# EAGLE design Program Counter (EAGLE 9.5.2)
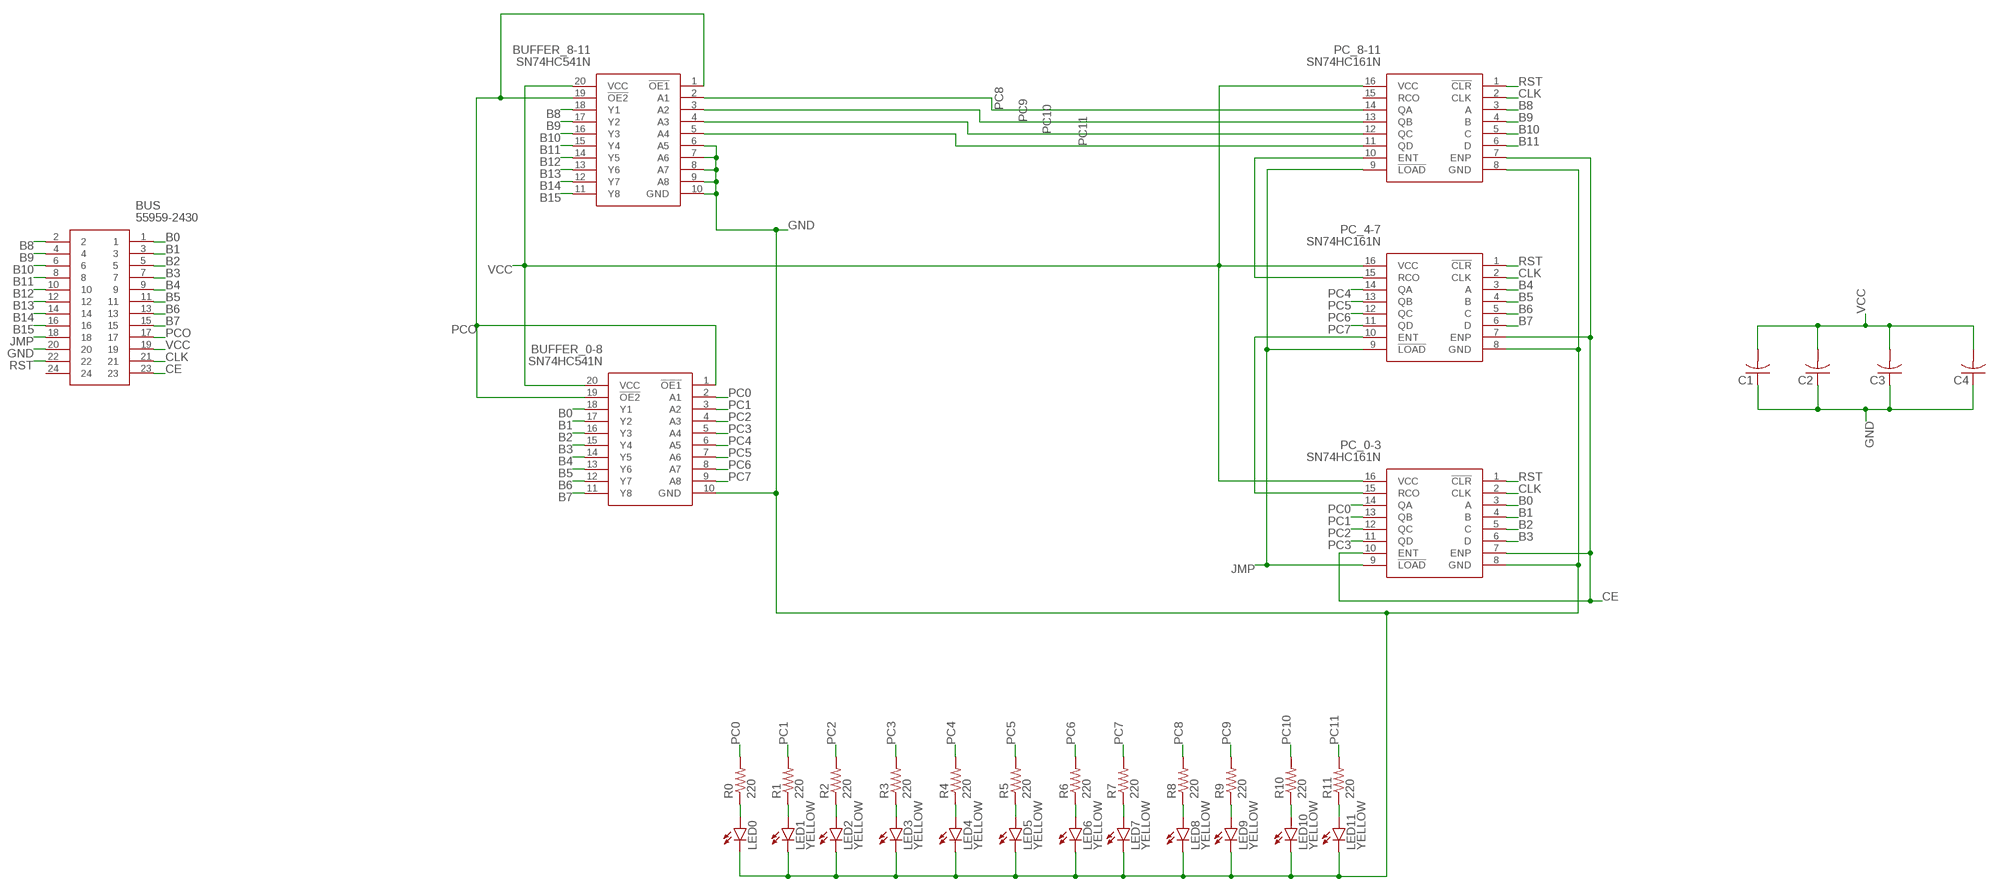
[diagram p0: schematic, sheet 1]

## Parts
BUFFER_0-8  SN74HC541N  [DIP794W53P254L2540H508Q20N]
BUFFER_8-11  SN74HC541N  [DIP794W53P254L2540H508Q20N]
BUS  55959-2430  [559592430]
C1  C-US025-024X044  [C025-024X044]
C2  C-US025-024X044  [C025-024X044]
C3  C-US025-024X044  [C025-024X044]
C4  C-US025-024X044  [C025-024X044]
LED0  LED3MM  [LED3MM]
LED1  YELLOW  LED3MM  [LED3MM]
LED2  YELLOW  LED3MM  [LED3MM]
LED3  YELLOW  LED3MM  [LED3MM]
LED4  YELLOW  LED3MM  [LED3MM]
LED5  YELLOW  LED3MM  [LED3MM]
LED6  YELLOW  LED3MM  [LED3MM]
LED7  YELLOW  LED3MM  [LED3MM]
LED8  YELLOW  LED3MM  [LED3MM]
LED9  YELLOW  LED3MM  [LED3MM]
LED10  YELLOW  LED3MM  [LED3MM]
LED11  YELLOW  LED3MM  [LED3MM]
PC_0-3  SN74HC161N  [DIP794W53P254L1930H508Q16N]
PC_4-7  SN74HC161N  [DIP794W53P254L1930H508Q16N]
PC_8-11  SN74HC161N  [DIP794W53P254L1930H508Q16N]
R0  220  R-US_0204/7  [0204/7]
R1  220  R-US_0204/7  [0204/7]
R2  220  R-US_0204/7  [0204/7]
R3  220  R-US_0204/7  [0204/7]
R4  220  R-US_0204/7  [0204/7]
R5  220  R-US_0204/7  [0204/7]
R6  220  R-US_0204/7  [0204/7]
R7  220  R-US_0204/7  [0204/7]
R8  220  R-US_0204/7  [0204/7]
R9  220  R-US_0204/7  [0204/7]
R10  220  R-US_0204/7  [0204/7]
R11  220  R-US_0204/7  [0204/7]

## Nets
B0: BUFFER_0-8.18(Y1) BUS.1 PC_0-3.3(A)
B1: BUFFER_0-8.17(Y2) BUS.3 PC_0-3.4(B)
B2: BUFFER_0-8.16(Y3) BUS.5 PC_0-3.5(C)
B3: BUFFER_0-8.15(Y4) BUS.7 PC_0-3.6(D)
B4: BUFFER_0-8.14(Y5) BUS.9 PC_4-7.3(A)
B5: BUFFER_0-8.13(Y6) BUS.11 PC_4-7.4(B)
B6: BUFFER_0-8.12(Y7) BUS.13 PC_4-7.5(C)
B7: BUFFER_0-8.11(Y8) BUS.15 PC_4-7.6(D)
B8: BUFFER_8-11.18(Y1) BUS.2 PC_8-11.3(A)
B9: BUFFER_8-11.17(Y2) BUS.4 PC_8-11.4(B)
B10: BUFFER_8-11.16(Y3) BUS.6 PC_8-11.5(C)
B11: BUFFER_8-11.15(Y4) BUS.8 PC_8-11.6(D)
B12: BUFFER_8-11.14(Y5) BUS.10
B13: BUFFER_8-11.13(Y6) BUS.12
B14: BUFFER_8-11.12(Y7) BUS.14
B15: BUFFER_8-11.11(Y8) BUS.16
CE: BUS.23 PC_0-3.7(ENP) PC_0-3.10(ENT) PC_4-7.7(ENP) PC_8-11.7(ENP)
CLK: BUS.21 PC_0-3.2(CLK) PC_4-7.2(CLK) PC_8-11.2(CLK)
GND: BUFFER_0-8.10(GND) BUFFER_8-11.6(A5) BUFFER_8-11.7(A6) BUFFER_8-11.8(A7) BUFFER_8-11.9(A8) BUFFER_8-11.10(GND) BUS.20 C1.1 C2.1 C3.1 C4.1 LED0.K(C) LED1.K(C) LED2.K(C) LED3.K(C) LED4.K(C) LED5.K(C) LED6.K(C) LED7.K(C) LED8.K(C) LED9.K(C) LED10.K(C) LED11.K(C) PC_0-3.8(GND) PC_4-7.8(GND) PC_8-11.8(GND)
JMP: BUS.18 PC_0-3.9(!LOAD) PC_4-7.9(!LOAD) PC_8-11.9(!LOAD)
N$2: PC_0-3.15(RCO) PC_4-7.10(ENT)
N$3: PC_4-7.15(RCO) PC_8-11.10(ENT)
N$5: LED0.A R0.1
N$6: LED1.A R1.1
N$7: LED2.A R2.1
N$9: LED3.A R3.1
N$10: LED4.A R4.1
N$11: LED5.A R5.1
N$12: LED6.A R6.1
N$13: LED7.A R7.1
N$14: LED8.A R8.1
N$15: LED9.A R9.1
N$16: LED10.A R10.1
N$17: LED11.A R11.1
PC0: BUFFER_0-8.2(A1) PC_0-3.14(QA) R0.2
PC1: BUFFER_0-8.3(A2) PC_0-3.13(QB) R1.2
PC2: BUFFER_0-8.4(A3) PC_0-3.12(QC) R2.2
PC3: BUFFER_0-8.5(A4) PC_0-3.11(QD) R3.2
PC4: BUFFER_0-8.6(A5) PC_4-7.14(QA) R4.2
PC5: BUFFER_0-8.7(A6) PC_4-7.13(QB) R5.2
PC6: BUFFER_0-8.8(A7) PC_4-7.12(QC) R6.2
PC7: BUFFER_0-8.9(A8) PC_4-7.11(QD) R7.2
PC8: BUFFER_8-11.2(A1) PC_8-11.14(QA) R8.2
PC9: BUFFER_8-11.3(A2) PC_8-11.13(QB) R9.2
PC10: BUFFER_8-11.4(A3) PC_8-11.12(QC) R10.2
PC11: BUFFER_8-11.5(A4) PC_8-11.11(QD) R11.2
PCO: BUFFER_0-8.1(!OE1) BUFFER_0-8.19(!OE2) BUFFER_8-11.1(!OE1) BUFFER_8-11.19(!OE2) BUS.17
RST: BUS.22 PC_0-3.1(!CLR) PC_4-7.1(!CLR) PC_8-11.1(!CLR)
VCC: BUFFER_0-8.20(VCC) BUFFER_8-11.20(VCC) BUS.19 C1.2 C2.2 C3.2 C4.2 PC_0-3.16(VCC) PC_4-7.16(VCC) PC_8-11.16(VCC)
Unconnected: BUS.24 PC_8-11.15(RCO)

## Library data of the parts
BUFFER_0-8 BUFFER_8-11 = SamacSys_Parts:SN74HC541N: Octal Buffers And Line Drivers With 3-State Outputs Source: Datasheet <http://componentsearchengine.com/Datasheets/3/SN74HC541N.pdf>; DESCRIPTION: Octal Buffers And Line Drivers With 3-State Outputs; HEIGHT: 5.08mm; MANUFACTURER_NAME: Texas Instruments; MANUFACTURER_PART_NUMBER: SN74HC541N; MOUSER_PART_NUMBER: 595-SN74HC541N; MOUSER_PRICE-STOCK: https://www.mouser.com/Search/Refine.aspx?Keyword=595-SN74HC541N
BUS = SamacSys_Parts:55959-2430: Headers & Wire Housings 24 Ckt R.A. Header Source: Datasheet <https://componentsearchengine.com/Datasheets/1/55959-2430.pdf>; DESCRIPTION: Headers & Wire Housings 24 Ckt R.A. Header; HEIGHT: 11.95mm; MANUFACTURER_NAME: Molex; MANUFACTURER_PART_NUMBER: 55959-2430; MOUSER_PART_NUMBER: 538-55959-2430; MOUSER_PRICE-STOCK: https://www.mouser.com/Search/Refine.aspx?Keyword=538-55959-2430
C1-C4 = rcl:C-US: CAPACITOR, American symbol; SPICEPREFIX: C
LED0 LED1-LED11 = led:LED: LED OSRAM: - CHIPLED LG R971, LG N971, LY N971, LG Q971, LY Q971, LO R971, LY R971 LH N974, LH R974 LS Q976, LO Q976, LY Q976 LO Q996 - Hyper CHIPLED LW Q18S LB Q993, LB Q99A, LB R99A - SideLED LS A670, LO A670, LY A670, LG A670, LP A670 LB A673, LV A673, LT A673, LW A673 LH A674 LY A675 LS A676, LA A676, LO A676, LY A676, LW A676 LS A679, LY A679, LG A679 - Hyper Micro SIDELED® LS Y876, LA Y876, LO Y876, LY Y876 LT Y87S - SmartLED LW L88C, LW L88S LB L89C, LB L89S, LG L890 LS L89K, LO L89K, LY L89K LS L896, LA L896, LO L896, LY L896 - TOPLED LS T670, LO T670, LY T670, LG T670, LP T670 LSG T670, LSP T670, LSY T670, LOP T670, LYG T670 LG T671, LOG T671, LSG T671 LB T673, LV T673, LT T673, LW T673 LH T674 LS T676, LA T676, LO T676, LY T676, LB T676, LH T676, LSB T676, LW T676 LB T67C, LV T67C, LT T67C, LS T67K, LO T67K, LY T67K, LW E67C LS E67B, LA E67B, LO E67B, LY E67B, LB E67C, LV E67C, LT E67C LW T67C LS T679, LY T679, LG T679 LS T770, LO T770, LY T770, LG T770, LP T770 LB T773, LV T773, LT T773, LW T773 LH T774 LS E675, LA E675, LY E675, LS T675 LS T776, LA T776, LO T776, LY T776, LB T776 LHGB T686 LT T68C, LB T68C - Hyper Mini TOPLED® LB M676 - Mini TOPLED Santana® LG M470 LS M47K, LO M47K, LY M47K Source: http://www.osram.convergy.de LUXEON: - LUMILED® LXK2-PW12-R00, LXK2-PW12-S00, LXK2-PW14-U00, LXK2-PW14-V00 LXK2-PM12-R00, LXK2-PM12-S00, LXK2-PM14-U00 LXK2-PE12-Q00, LXK2-PE12-R00, LXK2-PE12-S00, LXK2-PE14-T00, LXK2-PE14-U00 LXK2-PB12-K00, LXK2-PB12-L00, LXK2-PB12-M00, LXK2-PB14-N00, LXK2-PB14-P00, LXK2-PB14-Q00 LXK2-PR12-L00, LXK2-PR12-M00, LXK2-PR14-Q00, LXK2-PR14-R00 LXK2-PD12-Q00, LXK2-PD12-R00, LXK2-PD12-S00 LXK2-PH12-R00, LXK2-PH12-S00 LXK2-PL12-P00, LXK2-PL12-Q00, LXK2-PL12-R00 Source: www.luxeon.com KINGBRIGHT: KA-3528ASYC Source: www.kingbright.com
PC_0-3 PC_4-7 PC_8-11 = SamacSys_Parts:SN74HC161N: SYNCHRONOUS 4-BIT BINARY COUNTERS Source: Datasheet <http://www.ti.com/lit/gpn/sn74hc161>; DESCRIPTION: SYNCHRONOUS 4-BIT BINARY COUNTERS; HEIGHT: 5.08mm; MANUFACTURER_NAME: Texas Instruments; MANUFACTURER_PART_NUMBER: SN74HC161N; MOUSER_PART_NUMBER: 595-SN74HC161N; MOUSER_PRICE-STOCK: https://www.mouser.com/Search/Refine.aspx?Keyword=595-SN74HC161N
R0 R1-R11 = rcl:R-US_: RESISTOR, American symbol; SPICEPREFIX: R

## Board
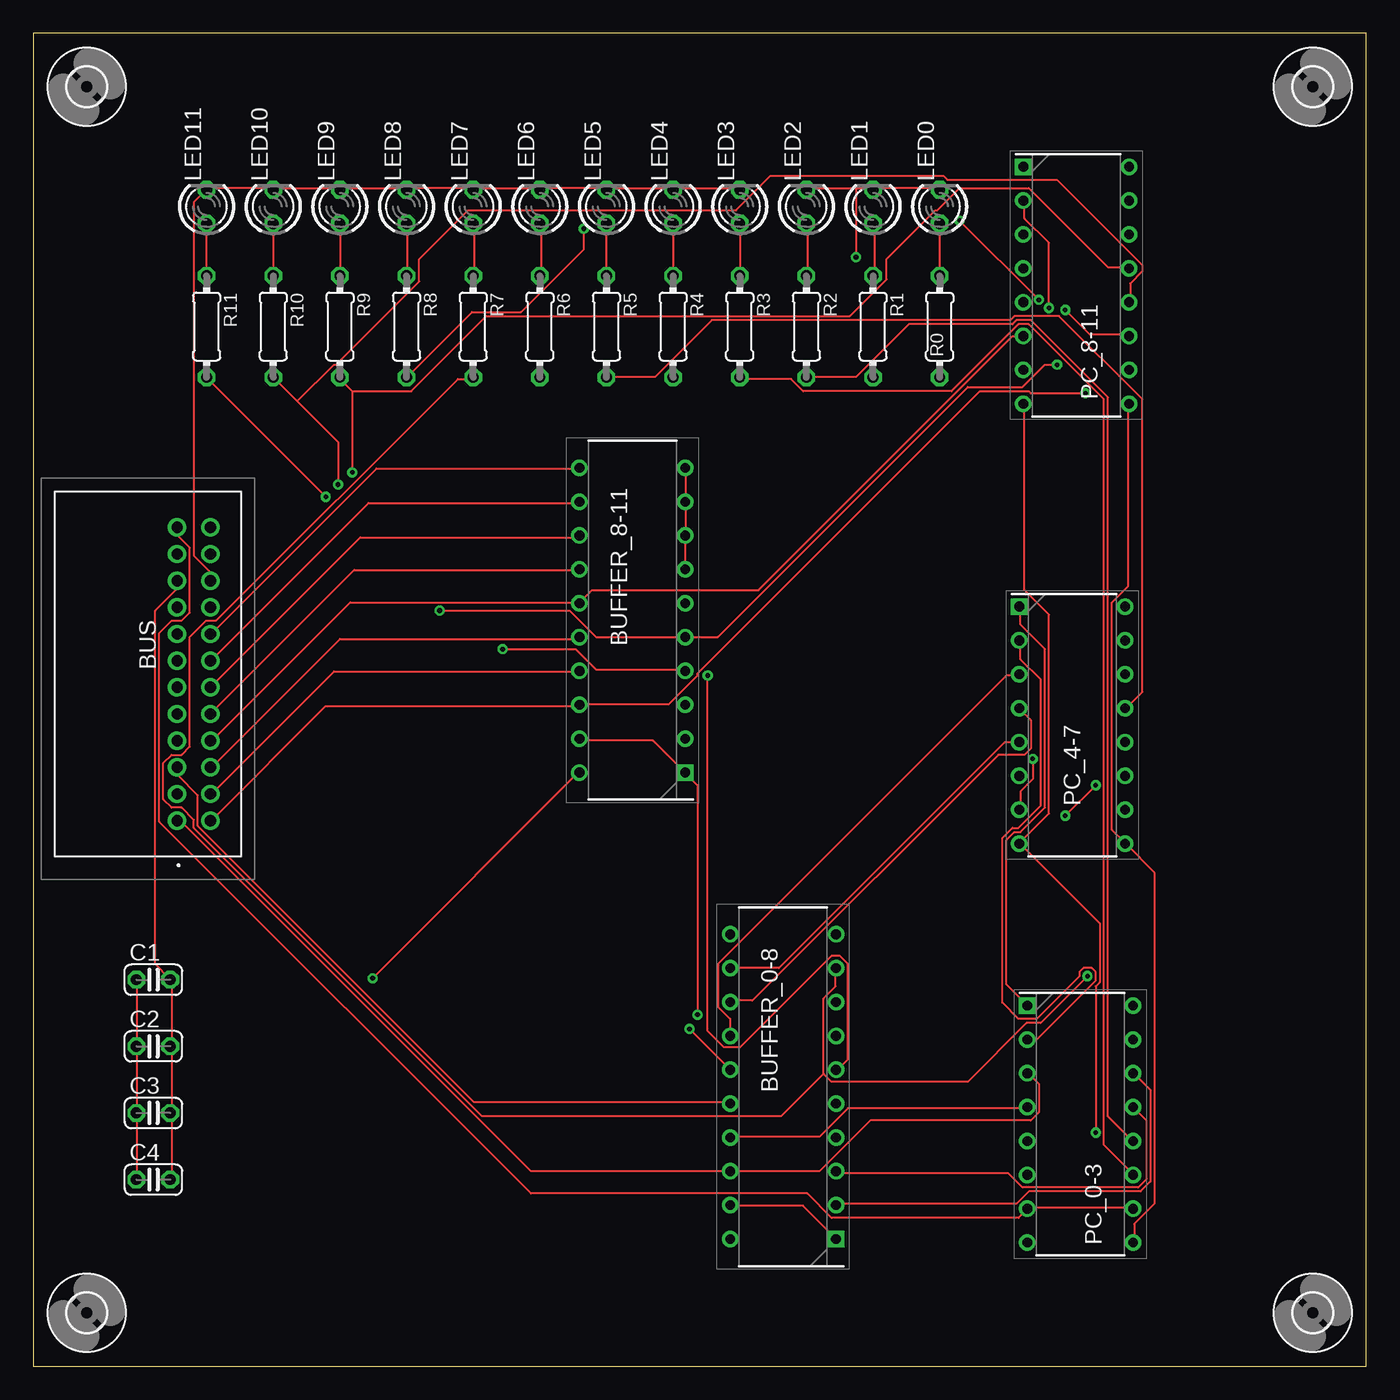
[diagram p1: board, top side]
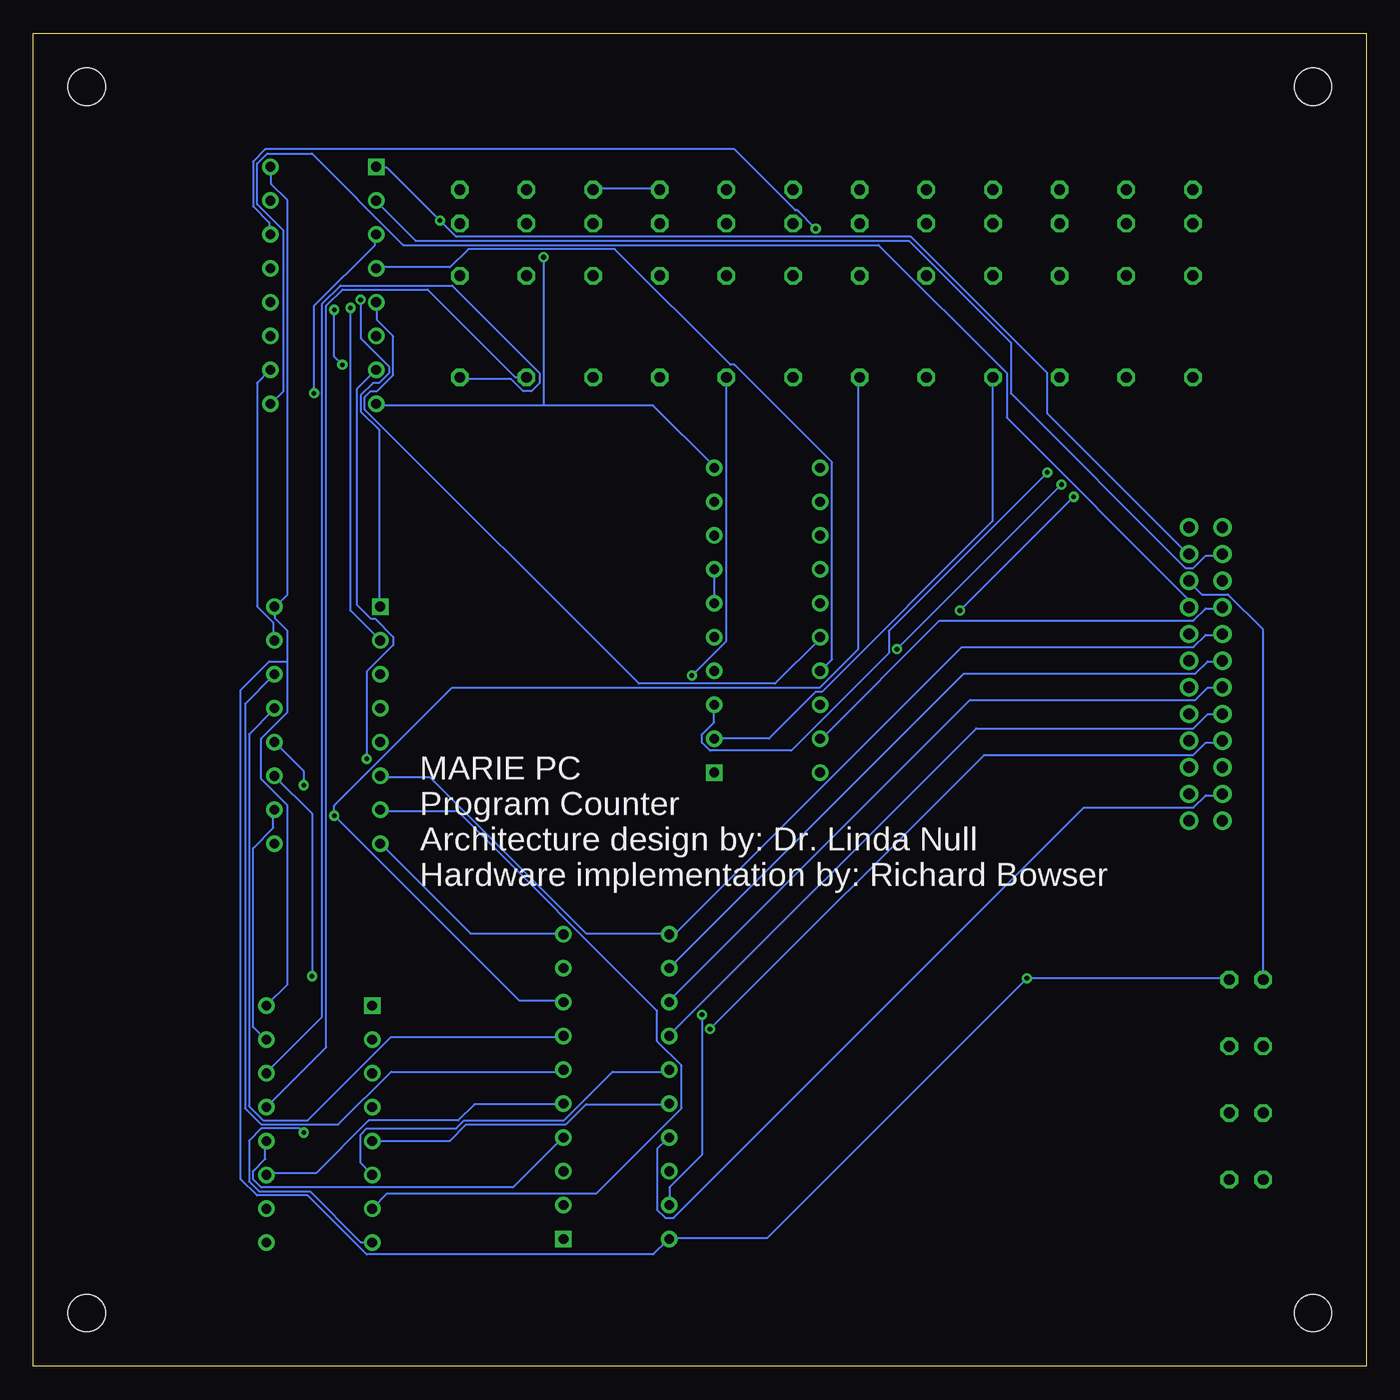
[diagram p2: board, bottom side, seen from below]

Size 100 x 100 mm. Coordinates in mm from the lower left corner, seen from the top.
Outline: 0,0 100,0 100,100 0,100 0,0
Copper layers (1*16): Top 0.035mm / dielectric 1.5mm / Bottom 0.035mm
Design rules "default": minimum track width 6mil, minimum drill 0.35mm, track to track 6mil, track to pad 6mil, pad to pad 6mil, via to via 6mil, smd to smd 6mil, copper to edge 40mil, drill to drill 6mil, minimum pad ring 10mil, minimum via ring 8mil, stop-mask expansion 4mil, vias tented up to drill 0mil, thermal gap 10mil

### Footprints (pad centres in the part's own frame; a part is rotated, then mirrored left to right if it is on the bottom)
DIP794W53P254L2540H508Q20N = drill 0.73 pad 1.13 square: 1 -3.97,11.43 | drill 0.73 pad 1.13: 2 -3.97,8.89; 3 -3.97,6.35; 4 -3.97,3.81; 5 -3.97,1.27; 6 -3.97,-1.27; 7 -3.97,-3.81; 8 -3.97,-6.35; 9 -3.97,-8.89; 10 -3.97,-11.43; 11 3.97,-11.43; 12 3.97,-8.89; 13 3.97,-6.35; 14 3.97,-3.81; 15 3.97,-1.27; 16 3.97,1.27; 17 3.97,3.81; 18 3.97,6.35; 19 3.97,8.89; 20 3.97,11.43
559592430 = drill 0.85 pad 1.381: 1 0,0; 2 0,-2.5; 3 2,0; 4 2,-2.5; 5 4,0; 6 4,-2.5; 7 6,0; 8 6,-2.5; 9 8,0; 10 8,-2.5; 11 10,0; 12 10,-2.5; 13 12,0; 14 12,-2.5; 15 14,0; 16 14,-2.5; 17 16,0; 18 16,-2.5; 19 18,0; 20 18,-2.5; 21 20,0; 22 20,-2.5; 23 22,0; 24 22,-2.5
C025-024X044 = drill 0.813 octagon: 1 -1.27,0; 2 1.27,0
LED3MM = drill 0.813 octagon: A -1.27,0; K 1.27,0
DIP794W53P254L1930H508Q16N = drill 0.73 pad 1.13 square: 1 -3.97,8.89 | drill 0.73 pad 1.13: 2 -3.97,6.35; 3 -3.97,3.81; 4 -3.97,1.27; 5 -3.97,-1.27; 6 -3.97,-3.81; 7 -3.97,-6.35; 8 -3.97,-8.89; 9 3.97,-8.89; 10 3.97,-6.35; 11 3.97,-3.81; 12 3.97,-1.27; 13 3.97,1.27; 14 3.97,3.81; 15 3.97,6.35; 16 3.97,8.89
0204/7 = drill 0.813 octagon: 1 -3.81,0; 2 3.81,0
2,8 = hole 2.8: 0,0

### Placement (x,y rotation side)
BUFFER_0-8  56.25,20.97 180 top
BUFFER_8-11  44.95,55.97 180 top
BUS  10.79,40.93 90 top
C1  9,29 0 top
C2  9,24 0 top
C3  9,19 0 top
C4  9,14 0 top
LED0  YELLOW  [LED3MM]  68,87 90 top
LED1  63,87 90 top
LED2  58,87 90 top
LED3  53,87 90 top
LED4  48,87 90 top
LED5  43,87 90 top
LED6  38,87 90 top
LED7  33,87 90 top
LED8  28,87 90 top
LED9  23,87 90 top
LED10  18,87 90 top
LED11  13,87 90 top
PC_0-3  78.55,18.16 0 top
PC_4-7  77.95,48.1 0 top
PC_8-11  78.25,81.1 0 top
R0  68,78 270 top
R1  63,78 270 top
R2  58,78 270 top
R3  53,78 270 top
R4  48,78 270 top
R5  43,78 270 top
R6  38,78 270 top
R7  33,78 270 top
R8  28,78 270 top
R9  23,78 270 top
R10  18,78 270 top
R11  13,78 270 top
U$1  [2,8]  4,4 0 top
U$2  [2,8]  96,4 0 top
U$3  [2,8]  96,96 0 top
U$4  [2,8]  4,96 0 top

### Tracks (layer width: path | path; a pad name or v marks a point on that pad's centre or on a via)
B0
  Top 0.152: PC_0-3.3 74.68,21.95 75.44,21.18 75.44,19.05 74.83,18.44 62.79,18.44 58.98,14.63 52.43,14.63 BUFFER_0-8.18 37.34,14.63 11.12,40.84 10.82,40.84 BUS.1
B1
  Top 0.152: BUFFER_0-8.17 52.43,17.22 58.98,17.22 61.11,19.36 74.52,19.36 PC_0-3.4
  Bottom 0.152: BUS.3 10.82,42.82 12.04,42.82 12.95,41.91 21.18,41.91 51.97,11.12 52.58,11.12 53.19,11.73 53.19,16.31 52.43,17.07 BUFFER_0-8.17
B2
  Top 0.152: BUS.5 10.82,44.81 10.82,44.35 12.34,42.82 12.34,40.54 33.07,19.81 52.27,19.81 BUFFER_0-8.16
  Bottom 0.152: BUFFER_0-8.16 52.43,19.66 58.52,19.66 60.05,18.14 67.51,18.14 68.73,16.92 74.52,16.92 PC_0-3.5
B3  (via drill 0.35)
  Top 0.152: v49.23,25.3 BUFFER_0-8.15
  Bottom 0.152: BUFFER_0-8.15 52.43,22.1 56.54,22.1 60.2,18.44 67.67,18.44 68.28,17.83 74.98,17.83 75.44,17.37 75.44,15.24 74.68,14.48 PC_0-3.6 | v49.23,25.3 28.65,45.87 12.95,45.87 12.04,46.79 10.82,46.79 BUS.7
B4
  Top 0.152: BUFFER_0-8.14 52.27,24.84 52.27,26.06 51.36,26.98 51.36,30.18 73,51.82 73.91,51.82 PC_4-7.3
  Bottom 0.152: BUS.9 10.82,48.92 11.89,48.92 12.95,47.85 29.26,47.85 52.27,24.84 BUFFER_0-8.14
B5
  Top 0.152: BUFFER_0-8.13 52.43,27.43 53.95,27.43 72.39,45.87 74.37,45.87 74.83,46.33 74.83,48.46 74.07,49.23 PC_4-7.4
  Bottom 0.152: BUS.11 10.82,50.9 11.89,50.9 12.8,49.99 29.72,49.99 52.27,27.43 BUFFER_0-8.13
B6
  Top 0.152: BUFFER_0-8.12 52.43,29.87 55.93,29.87 72.85,46.79 73.91,46.79 PC_4-7.5
  Bottom 0.152: BUS.13 10.82,52.88 11.89,52.88 12.8,51.97 30.18,51.97 BUFFER_0-8.12
B7
  Bottom 0.152: PC_4-7.6 73.91,44.2 70.26,44.2 58.52,32.46 52.43,32.46 BUFFER_0-8.11 52.27,32.46 51.82,32.46 30.33,53.95 12.95,53.95 12.04,54.86 10.82,54.86 BUS.15
B8  (via drill 0.35)
  Top 0.152: BUS.2 13.41,41 21.95,49.53 40.84,49.53 BUFFER_8-11.18 41,49.68 47.7,49.68 49.84,51.82 49.84,51.97 71.02,73.15 74.68,73.15 74.83,73 v78.94,73
  Bottom 0.152: v78.94,73 78.94,79.55 74.37,84.12 74.37,84.89 PC_8-11.3
B9
  Top 0.152: BUFFER_8-11.17 40.84,52.12 22.55,52.12 13.41,42.98 BUS.4
  Bottom 0.152: PC_8-11.4 74.22,82.45 68.73,82.45 67.36,83.82 56.39,83.82 47.7,75.13 47.4,75.13 40.08,67.82 40.08,53.03 40.84,52.27 BUFFER_8-11.17
B10
  Top 0.152: BUFFER_8-11.16 40.84,54.56 23.01,54.56 13.41,44.96 BUS.6
  Bottom 0.152: PC_8-11.5 74.22,79.7 74.22,78.49 73,77.27 73,74.37 74.22,73.15 74.68,73.15 75.13,72.69 75.13,71.78 54.56,51.21 44.35,51.21 41,54.56 BUFFER_8-11.16
B11
  Top 0.152: BUS.8 13.41,46.94 23.77,57.3 40.84,57.3 BUFFER_8-11.15 41,57.3 41.91,58.22 54.41,58.22 73.46,77.27 74.22,77.27 PC_8-11.6
B12
  Top 0.152: BUFFER_8-11.14 40.84,59.74 24.08,59.74 13.41,49.07 BUS.10
B13
  Top 0.152: BUFFER_8-11.13 40.84,62.18 24.54,62.18 13.41,51.05 BUS.12
B14
  Top 0.152: BUFFER_8-11.12 40.84,64.77 25.15,64.77 13.41,53.03 BUS.14
B15
  Top 0.152: BUFFER_8-11.11 40.84,67.36 25.76,67.36 13.41,55.02 BUS.16
CE  (via drill 0.35)
  Top 0.152: v74.98,45.57 74.98,44.04 74.07,43.13 74.07,41.76 PC_4-7.7 | PC_0-3.10 82.45,11.89 74.68,11.89 PC_0-3.7 74.52,11.73 73.91,11.12 59.89,11.12 58.06,12.95 37.34,12.95 9.45,40.84 9.45,55.02 10.36,55.93 11.12,55.93 11.73,56.54 11.73,61.42 10.82,62.33 10.82,62.79 BUS.23
  Bottom 0.152: v74.98,45.57 74.98,52.12 73,54.1 73,54.71 74.37,56.08 74.68,56.08 75.74,57.15 75.74,73.3 74.37,74.68 PC_8-11.7 | PC_4-7.7 73.91,41.6 68.12,41.6 53.19,26.67 53.19,24.38 51.36,22.55 51.36,19.36 57.76,12.95 73.46,12.95 74.52,11.89 PC_0-3.7
CLK  (via drill 0.35)
  Top 0.152: PC_4-7.2 74.07,54.41 74.07,53.03 75.59,51.51 75.59,42.06 73.91,40.39 73.46,40.39 72.69,39.62 72.69,27.28 73.91,26.06 75.29,26.06 78.49,29.26 78.49,29.57 78.79,29.87 79.4,29.87 79.7,29.57 79.7,28.96 75.29,24.54 74.68,24.54 PC_0-3.2 | v76.2,79.4 76.2,84.28 74.37,86.11 74.37,87.33 PC_8-11.2
  Bottom 0.152: v76.2,79.4 76.2,56.69 74.07,54.56 PC_4-7.2 | BUS.21 10.82,60.81 12.04,60.81 12.95,59.89 13.56,59.89 26.67,73 26.67,76.81 34.29,84.43 71.32,84.43 74.22,87.33 PC_8-11.2
GND  (via drill 0.35)
  Top 0.152: BUFFER_8-11.7 48.92,59.89 48.92,62.18 BUFFER_8-11.8 48.92,62.33 48.92,64.77 BUFFER_8-11.9 48.92,64.92 48.92,67.36 BUFFER_8-11.10 | v79.7,17.53 79.7,28.5 80.01,28.8 80.01,33.22 74.07,39.17 PC_4-7.8 74.07,39.32 76.2,41.45 76.2,56.39 74.37,58.22 74.37,72.08 PC_8-11.8 | LED0.K 67.97,88.39 63.09,88.39 LED1.K 62.94,88.39 61.72,88.39 | LED3.K 52.88,88.39 48.01,88.39 LED4.K 47.85,88.39 43.13,88.39 LED5.K 42.98,88.39 38.1,88.39 LED6.K 37.95,88.39 33.07,88.39 LED7.K 32.92,88.39 28.04,88.39 LED8.K 27.89,88.39 23.01,88.39 LED9.K 22.86,88.39 18.14,88.39 LED10.K 17.98,88.39 13.11,88.39 LED11.K 12.95,88.24 12.04,87.33 12.04,60.81 13.26,59.59 13.26,58.98 BUS.20 | 61.72,88.39 58.06,88.39 LED2.K | C4.1 7.77,14.02 7.77,18.9 C3.1 7.77,19.05 7.77,23.93 C2.1 7.77,24.08 7.77,28.96 C1.1 | 61.72,88.39 v61.72,83.21
  Bottom 0.152: BUFFER_8-11.6 48.92,57.3 48.92,59.74 BUFFER_8-11.7 | 61.72,72.08 53.49,72.08 48.92,67.51 BUFFER_8-11.10 | 61.72,72.08 74.22,72.08 PC_8-11.8 | BUFFER_0-8.10 60.35,32.46 67.21,32.46 73.91,39.17 PC_4-7.8 | v79.7,17.53 80.01,17.83 82.91,17.83 83.82,16.92 83.82,13.87 83.06,13.11 79.25,13.11 75.44,9.3 74.68,9.3 PC_0-3.8 | LED3.K 53.03,88.39 57.91,88.39 LED2.K | C1.1 7.77,29.11 7.77,55.32 10.36,57.91 12.34,57.91 13.26,58.83 BUS.20 | v61.72,83.21 61.72,72.08
JMP
  Top 0.152: PC_0-3.9 82.6,9.3 82.6,10.67 84.12,12.19 84.12,37.03 81.99,39.17 PC_4-7.9 81.84,39.32 80.92,40.23 80.92,57.3 82.14,58.52 82.14,72.08 PC_8-11.9
  Bottom 0.152: BUS.18 13.41,57 13.41,57.61 26.98,71.17 26.98,74.52 36.58,84.12 72.24,84.12 79.1,90.98 82.45,90.98 83.21,90.22 83.21,87.17 81.23,85.19 81.23,73.15 82.14,72.24 PC_8-11.9
N$2
  Bottom 0.152: PC_4-7.10 81.99,41.6 81.99,40.39 83.52,38.86 83.52,25.45 82.6,24.54 PC_0-3.15
N$3
  Bottom 0.152: PC_4-7.15 81.99,54.56 81.99,55.78 83.21,57 83.21,73.76 82.3,74.68 PC_8-11.10
N$5
  Top 0.152: R0.1 67.97,81.84 67.97,85.65 LED0.A
N$6
  Top 0.152: R1.1 63.09,81.84 63.09,85.65 LED1.A
N$7
  Top 0.152: R2.1 58.06,81.84 58.06,85.65 LED2.A
N$9
  Top 0.152: R3.1 53.03,81.84 53.03,85.65 LED3.A
N$10
  Top 0.152: R4.1 48.01,81.84 48.01,85.65 LED4.A
N$11
  Top 0.152: R5.1 42.98,81.84 42.98,85.65 LED5.A
N$12
  Top 0.152: R6.1 38.1,81.84 38.1,85.65 LED6.A
N$13
  Top 0.152: R7.1 33.07,81.84 33.07,85.65 LED7.A
N$14
  Top 0.152: R8.1 28.04,81.84 28.04,85.65 LED8.A
N$15
  Top 0.152: R9.1 23.01,81.84 23.01,85.65 LED9.A
N$16
  Top 0.152: R10.1 17.98,81.84 17.98,85.65 LED10.A
N$17
  Top 0.152: R11.1 12.95,81.84 12.95,85.65 LED11.A
PC0
  Top 0.152: BUFFER_0-8.2 60.35,12.19 73.76,12.19 74.68,13.11 83.06,13.11 83.82,13.87 83.82,20.73 82.6,21.95 PC_0-3.14
  Bottom 0.152: R0.2 67.97,74.07 64.16,74.07 63.25,73.15 62.64,73.15 62.03,73.76 62.03,74.52 68.58,81.08 76.96,81.08 78.33,79.7 78.33,26.21 82.45,22.1 PC_0-3.14
PC1
  Top 0.152: BUFFER_0-8.3 60.35,14.48 73.15,14.48 74.22,13.41 82.91,13.41 83.52,14.02 83.52,18.44 82.6,19.36 PC_0-3.13
  Bottom 0.152: R1.2 63.09,74.22 63.86,74.22 70.41,80.77 76.81,80.77 78.03,79.55 78.03,23.93 82.45,19.51 PC_0-3.13
PC2
  Top 0.152: R2.2 58.06,74.22 61.72,74.22 65.68,78.18 73.46,78.18 73.76,78.49 74.83,78.49 80.62,72.69 80.62,18.75 82.45,16.92 PC_0-3.12
  Bottom 0.152: PC_0-3.12 82.6,16.76 82.6,15.54 83.52,14.63 83.52,14.02 82.91,13.41 64.01,13.41 60.35,17.07 BUFFER_0-8.4
PC3
  Top 0.152: R3.2 53.03,74.07 56.84,74.07 57.76,73.15 68.89,73.15 73.91,78.18 74.68,78.18 80.31,72.54 80.31,16.61 82.45,14.48 PC_0-3.11
  Bottom 0.152: PC_0-3.11 82.45,14.48 78.79,14.48 74.83,18.44 68.12,18.44 66.9,19.66 60.35,19.66 BUFFER_0-8.5
PC4  (via drill 0.35)
  Top 0.152: v50.6,51.82 50.6,25.15 51.82,23.93 53.03,23.93 59.89,30.79 60.5,30.79 61.11,30.18 61.11,23.01 60.35,22.25 BUFFER_0-8.6
  Bottom 0.152: BUFFER_0-8.6 60.35,22.1 73.15,22.1 77.11,18.14 82.91,18.14 84.12,19.36 84.12,49.68 81.99,51.82 PC_4-7.14 | v50.6,51.82 48.01,54.41 48.01,74.07 R4.2
PC5
  Top 0.152: R5.2 43.13,74.22 46.63,74.22 50.9,78.49 73.3,78.49 73.61,78.79 76.96,78.79 83.21,72.54 83.21,50.6 81.99,49.38 PC_4-7.13
  Bottom 0.152: BUFFER_0-8.7 60.35,24.69 73.15,24.69 79.4,18.44 82.75,18.44 83.82,19.51 83.82,47.4 81.99,49.23 PC_4-7.13
PC6  (via drill 0.35)
  Top 0.152: v79.7,43.59 v77.42,41.3
  Bottom 0.152: v79.7,43.59 79.7,44.65 81.84,46.79 PC_4-7.12 | BUFFER_0-8.8 60.35,27.43 63.55,27.43 v77.42,41.3 77.42,42.06 68.58,50.9 41,50.9 38.1,53.8 38.1,74.07 R6.2
PC7  (via drill 0.35)
  Top 0.152: 59.28,21.95 59.28,27.58 60.2,28.5 60.2,29.72 BUFFER_0-8.9 | 59.28,21.95 59.89,21.34 70.1,21.34 74.52,25.76 75.59,25.76 v79.1,29.26 | 59.28,21.95 56.08,18.75 33.68,18.75 12.04,40.39 12.04,41 11.12,41.91 10.36,41.91 9.75,42.52 9.75,45.26 10.36,45.87 11.12,45.87 11.73,46.48 11.73,54.71 12.95,55.93 13.72,55.93 31.85,74.07 32.92,74.07 R7.2
  Bottom 0.152: v79.1,29.26 79.1,41.45 81.84,44.2 PC_4-7.11
PC8  (via drill 0.35)
  Top 0.152: v41.3,85.34 41.3,83.82 36.58,79.1 32.92,79.1 28.04,74.22 R8.2
  Bottom 0.152: BUFFER_8-11.2 48.77,47.09 44.81,47.09 41.3,50.6 40.84,50.6 28.04,63.4 28.04,74.07 R8.2 | v41.3,85.34 42.67,86.72 42.82,86.72 47.4,91.29 82.6,91.29 83.52,90.37 83.52,87.02 82.3,85.8 82.3,85.04 PC_8-11.14
PC9  (via drill 0.35)
  Top 0.152: 23.93,73.15 v23.93,67.06 | 23.93,73.15 23.01,74.07 R9.2 | 23.93,73.15 28.35,73.15 33.98,78.79 61.27,78.79 64.01,81.53 64.01,83.06 67.67,86.72 67.82,86.72 69.49,88.39 74.68,88.39 80.62,82.45 82.14,82.45 PC_8-11.13
  Bottom 0.152: v23.93,67.06 35.81,55.17 35.81,53.49 43.13,46.18 49.23,46.18 49.84,46.79 49.84,47.4 48.92,48.31 48.92,49.53 BUFFER_8-11.3
PC10  (via drill 0.35)
  Top 0.152: v35.2,53.8 40.69,53.8 42.22,52.27 48.77,52.27 BUFFER_8-11.4 | v22.86,66.14 22.86,69.34 19.81,72.39 | 19.81,72.39 18.14,74.07 R10.2 | 19.81,72.39 22.55,75.13 22.71,75.13 28.96,81.38 28.96,83.06 32.61,86.72 52.73,86.72 55.32,89.31 68.28,89.31 68.58,89 76.81,89 83.21,82.6 83.21,82.14 82.3,81.23 82.3,79.86 PC_8-11.12
  Bottom 0.152: v22.86,66.14 v35.2,53.8
PC11  (via drill 0.35)
  Top 0.152: v30.48,56.69 40.23,56.69 42.22,54.71 48.77,54.71 BUFFER_8-11.5 48.92,54.71 51.36,54.71 70.1,73.46 74.22,73.46 75.89,75.13 v76.81,75.13 | v21.95,65.23 13.11,74.07 R11.2 | v77.42,79.25 79.25,77.42 82.14,77.42 PC_8-11.11
  Bottom 0.152: v21.95,65.23 v30.48,56.69 | v77.42,79.25 77.42,75.74 v76.81,75.13
PCO  (via drill 0.35)
  Top 0.152: BUFFER_0-8.19 52.43,12.04 57.76,12.04 60.2,9.6 BUFFER_0-8.1 | BUFFER_8-11.19 41,46.94 46.48,46.94 48.77,44.65 BUFFER_8-11.1 48.92,44.5 49.84,43.59 v49.84,26.36
  Bottom 0.152: BUS.17 10.82,56.84 12.04,56.84 12.95,55.93 32,55.93 40.84,47.09 BUFFER_8-11.19 | v49.84,26.36 49.84,15.85 52.27,13.41 52.27,12.19 BUFFER_0-8.19
RST  (via drill 0.35)
  Top 0.152: PC_4-7.1 74.07,56.84 74.07,55.63 75.89,53.8 75.89,41.91 74.07,40.08 73.61,40.08 73,39.47 73,28.65 74.52,27.13 PC_0-3.1 | v69.49,85.95 v75.44,80.01
  Bottom 0.152: PC_8-11.1 74.22,89.92 73.46,89.92 v69.49,85.95 68.28,84.73 34.14,84.73 23.93,74.52 23.93,71.48 13.41,60.96 BUS.22 | v75.44,80.01 75.44,77.11 73.3,74.98 73.3,74.52 74.07,73.76 74.52,73.76 75.44,72.85 75.44,71.63 74.07,70.26 74.07,57 PC_4-7.1
VCC  (via drill 0.35)
  Top 0.152: C4.2 10.36,14.02 10.36,18.9 C3.2 10.36,19.05 10.36,23.93 C2.2 10.36,24.08 10.36,28.96 C1.2 10.21,29.11 9.14,30.18 9.14,56.69 10.67,58.22 10.67,58.83 BUS.19 | v25.45,29.11 40.84,44.5 BUFFER_8-11.20
  Bottom 0.152: 80.92,52.88 80.92,49.07 82.91,47.09 82.91,44.04 80.92,42.06 80.92,28.65 82.45,27.13 PC_0-3.16 | 80.92,52.88 80.92,55.17 81.84,56.08 81.84,56.84 PC_4-7.16 81.84,57 80.92,57.91 80.92,87.48 82.14,88.7 82.14,89.92 PC_8-11.16 | C1.2 10.36,29.11 v25.45,29.11 44.96,9.6 52.27,9.6 BUFFER_0-8.20 52.43,9.45 53.49,8.38 74.98,8.38 79.4,12.8 83.21,12.8 84.43,14.02 84.43,50.75 82.3,52.88 80.92,52.88

### Text on the board
bNames: MARIE PC / Program Counter / Architecture design by: Dr. Linda Null / Hardware implementation by: Richard Bowser